# EasyEDA Pro project Uchicha .eprj

# Schematic uchiha
Board Name: uchiha; Create Date: 2025-07-20; Page Name: uchiha; Project Name: Uchicha; Schematic Name: uchiha; Update Date: 2025-07-20; File: uchiha; Id: /; Sheet: /
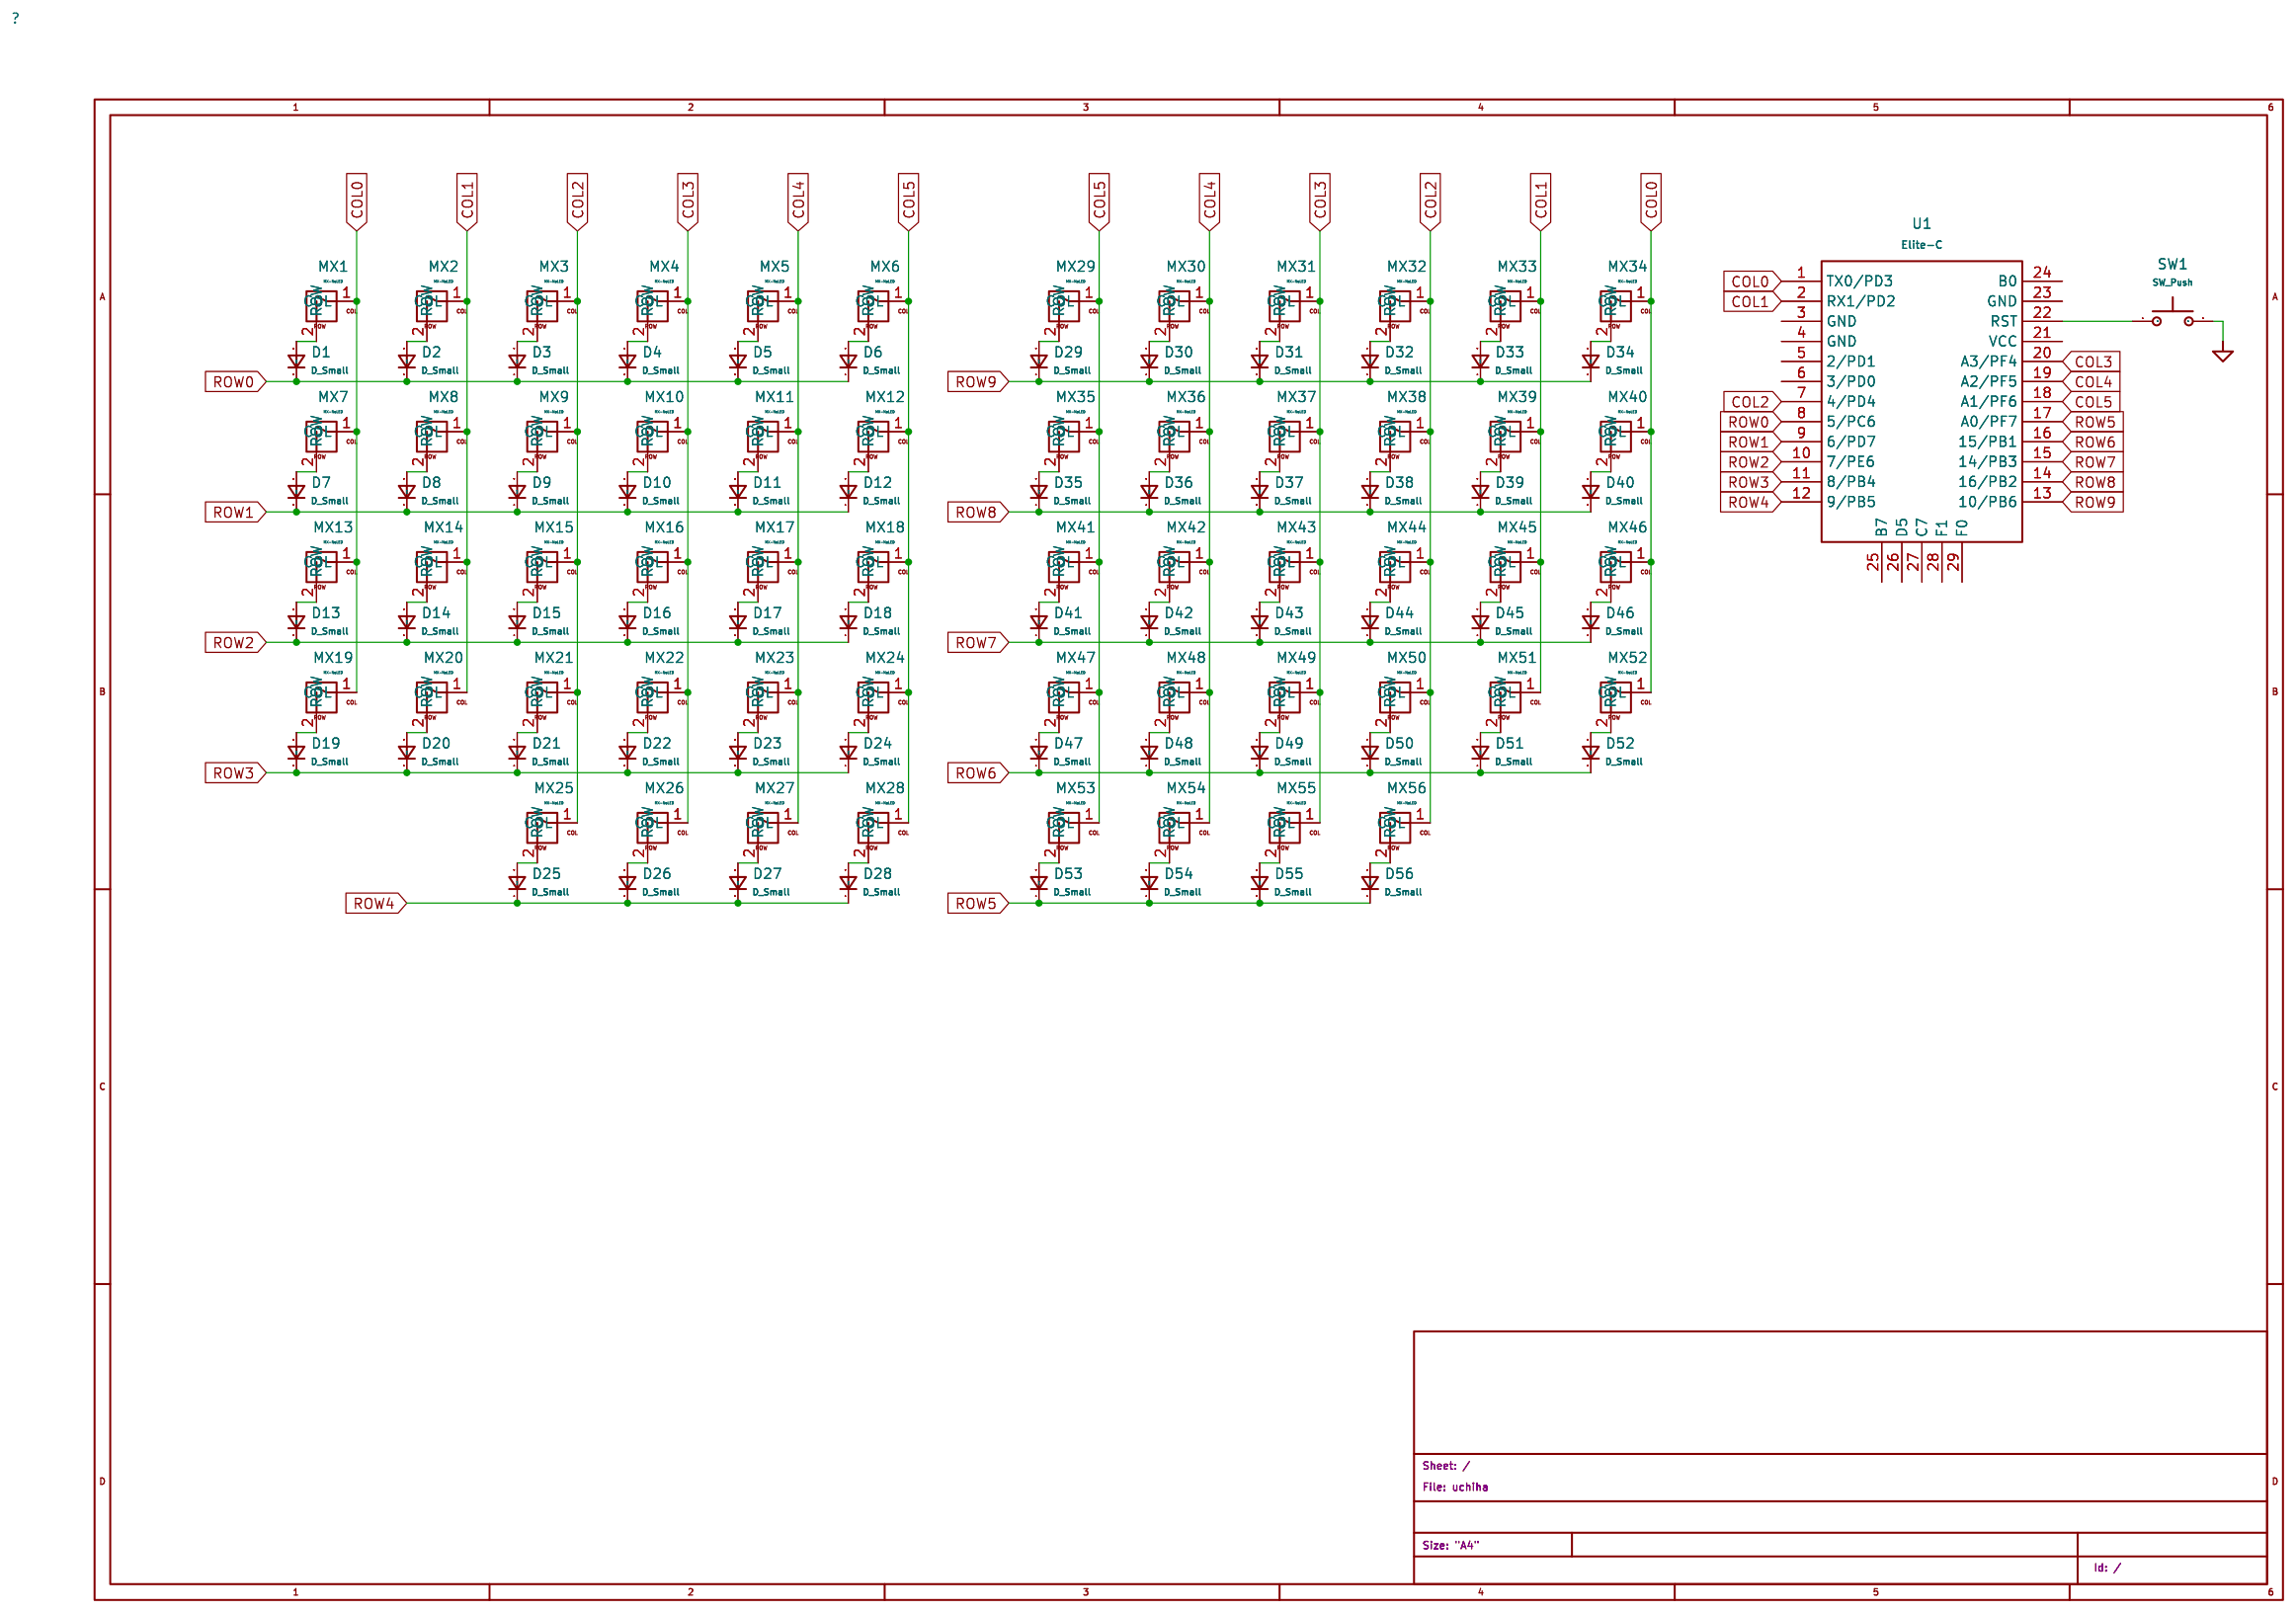
[diagram p0: schematic sheet]

## Parts
D1  D_Small
D2  D_Small
D3  D_Small
D4  D_Small
D5  D_Small
D6  D_Small
D7  D_Small
D8  D_Small
D9  D_Small
D10  D_Small
D11  D_Small
D12  D_Small
D13  D_Small
D14  D_Small
D15  D_Small
D16  D_Small
D17  D_Small
D18  D_Small
D19  D_Small
D20  D_Small
D21  D_Small
D22  D_Small
D23  D_Small
D24  D_Small
D25  D_Small
D26  D_Small
D27  D_Small
D28  D_Small
D29  D_Small
D30  D_Small
D31  D_Small
D32  D_Small
D33  D_Small
D34  D_Small
D35  D_Small
D36  D_Small
D37  D_Small
D38  D_Small
D39  D_Small
D40  D_Small
D41  D_Small
D42  D_Small
D43  D_Small
D44  D_Small
D45  D_Small
D46  D_Small
D47  D_Small
D48  D_Small
D49  D_Small
D50  D_Small
D51  D_Small
D52  D_Small
D53  D_Small
D54  D_Small
D55  D_Small
D56  D_Small
MX1  MX-NoLED
MX2  MX-NoLED
MX3  MX-NoLED
MX4  MX-NoLED
MX5  MX-NoLED
MX6  MX-NoLED
MX7  MX-NoLED
MX8  MX-NoLED
MX9  MX-NoLED
MX10  MX-NoLED
MX11  MX-NoLED
MX12  MX-NoLED
MX13  MX-NoLED
MX14  MX-NoLED
MX15  MX-NoLED
MX16  MX-NoLED
MX17  MX-NoLED
MX18  MX-NoLED
MX19  MX-NoLED
MX20  MX-NoLED
MX21  MX-NoLED
MX22  MX-NoLED
MX23  MX-NoLED
MX24  MX-NoLED
MX25  MX-NoLED
MX26  MX-NoLED
MX27  MX-NoLED
MX28  MX-NoLED
MX29  MX-NoLED
MX30  MX-NoLED
MX31  MX-NoLED
MX32  MX-NoLED
MX33  MX-NoLED
MX34  MX-NoLED
MX35  MX-NoLED
MX36  MX-NoLED
MX37  MX-NoLED
MX38  MX-NoLED
MX39  MX-NoLED
MX40  MX-NoLED
MX41  MX-NoLED
MX42  MX-NoLED
MX43  MX-NoLED
MX44  MX-NoLED
MX45  MX-NoLED
MX46  MX-NoLED
MX47  MX-NoLED
MX48  MX-NoLED
MX49  MX-NoLED
MX50  MX-NoLED
MX51  MX-NoLED
MX52  MX-NoLED
MX53  MX-NoLED
MX54  MX-NoLED
MX55  MX-NoLED
MX56  MX-NoLED
SW1  SW_Push
U1  Elite-C

## Library data of the parts
D1-D56 = Device_D_Small
MX1-MX56 = MX_Alps_Hybrid_MX-NoLED
SW1 = Switch_SW_Push
U1 = keebio_Elite-C

## Nets
COL0: MX1.1(COL) MX7.1(COL) MX13.1(COL) MX19.1(COL) MX34.1(COL) MX40.1(COL) MX46.1(COL) MX52.1(COL) U1.1(TX0/PD3)
COL1: MX2.1(COL) MX8.1(COL) MX14.1(COL) MX20.1(COL) MX33.1(COL) MX39.1(COL) MX45.1(COL) MX51.1(COL) U1.2(RX1/PD2)
COL2: MX3.1(COL) MX9.1(COL) MX15.1(COL) MX21.1(COL) MX25.1(COL) MX32.1(COL) MX38.1(COL) MX44.1(COL) MX50.1(COL) MX56.1(COL) U1.7(4/PD4)
COL3: MX4.1(COL) MX10.1(COL) MX16.1(COL) MX22.1(COL) MX26.1(COL) MX31.1(COL) MX37.1(COL) MX43.1(COL) MX49.1(COL) MX55.1(COL) U1.20(A3/PF4)
COL4: MX5.1(COL) MX11.1(COL) MX17.1(COL) MX23.1(COL) MX27.1(COL) MX30.1(COL) MX36.1(COL) MX42.1(COL) MX48.1(COL) MX54.1(COL) U1.19(A2/PF5)
COL5: MX6.1(COL) MX12.1(COL) MX18.1(COL) MX24.1(COL) MX28.1(COL) MX29.1(COL) MX35.1(COL) MX41.1(COL) MX47.1(COL) MX53.1(COL) U1.18(A1/PF6)
POWER_GND: SW1.2
ROW0: D1.1(K) D2.1(K) D3.1(K) D4.1(K) D5.1(K) D6.1(K) U1.8(5/PC6)
ROW1: D7.1(K) D8.1(K) D9.1(K) D10.1(K) D11.1(K) D12.1(K) U1.9(6/PD7)
ROW2: D13.1(K) D14.1(K) D15.1(K) D16.1(K) D17.1(K) D18.1(K) U1.10(7/PE6)
ROW3: D19.1(K) D20.1(K) D21.1(K) D22.1(K) D23.1(K) D24.1(K) U1.11(8/PB4)
ROW4: D25.1(K) D26.1(K) D27.1(K) D28.1(K) U1.12(9/PB5)
ROW5: D53.1(K) D54.1(K) D55.1(K) D56.1(K) U1.17(A0/PF7)
ROW6: D47.1(K) D48.1(K) D49.1(K) D50.1(K) D51.1(K) D52.1(K) U1.16(15/PB1)
ROW7: D41.1(K) D42.1(K) D43.1(K) D44.1(K) D45.1(K) D46.1(K) U1.15(14/PB3)
ROW8: D35.1(K) D36.1(K) D37.1(K) D38.1(K) D39.1(K) D40.1(K) U1.14(16/PB2)
ROW9: D29.1(K) D30.1(K) D31.1(K) D32.1(K) D33.1(K) D34.1(K) U1.13(10/PB6)
Net-(D1-2): D1.2(A) MX1.2(ROW)
Net-(D2-2): D2.2(A) MX2.2(ROW)
Net-(D3-2): D3.2(A) MX3.2(ROW)
Net-(D4-2): D4.2(A) MX4.2(ROW)
Net-(D5-2): D5.2(A) MX5.2(ROW)
Net-(D6-2): D6.2(A) MX6.2(ROW)
Net-(D7-2): D7.2(A) MX7.2(ROW)
Net-(D8-2): D8.2(A) MX8.2(ROW)
Net-(D9-2): D9.2(A) MX9.2(ROW)
Net-(D10-2): D10.2(A) MX10.2(ROW)
Net-(D11-2): D11.2(A) MX11.2(ROW)
Net-(D12-2): D12.2(A) MX12.2(ROW)
Net-(D13-2): D13.2(A) MX13.2(ROW)
Net-(D14-2): D14.2(A) MX14.2(ROW)
Net-(D15-2): D15.2(A) MX15.2(ROW)
Net-(D16-2): D16.2(A) MX16.2(ROW)
Net-(D17-2): D17.2(A) MX17.2(ROW)
Net-(D18-2): D18.2(A) MX18.2(ROW)
Net-(D19-2): D19.2(A) MX19.2(ROW)
Net-(D20-2): D20.2(A) MX20.2(ROW)
Net-(D21-2): D21.2(A) MX21.2(ROW)
Net-(D22-2): D22.2(A) MX22.2(ROW)
Net-(D23-2): D23.2(A) MX23.2(ROW)
Net-(D24-2): D24.2(A) MX24.2(ROW)
Net-(D25-2): D25.2(A) MX25.2(ROW)
Net-(D26-2): D26.2(A) MX26.2(ROW)
Net-(D27-2): D27.2(A) MX27.2(ROW)
Net-(D28-2): D28.2(A) MX28.2(ROW)
Net-(D29-2): D29.2(A) MX29.2(ROW)
Net-(D30-2): D30.2(A) MX30.2(ROW)
Net-(D31-2): D31.2(A) MX31.2(ROW)
Net-(D32-2): D32.2(A) MX32.2(ROW)
Net-(D33-2): D33.2(A) MX33.2(ROW)
Net-(D34-2): D34.2(A) MX34.2(ROW)
Net-(D35-2): D35.2(A) MX35.2(ROW)
Net-(D36-2): D36.2(A) MX36.2(ROW)
Net-(D37-2): D37.2(A) MX37.2(ROW)
Net-(D38-2): D38.2(A) MX38.2(ROW)
Net-(D39-2): D39.2(A) MX39.2(ROW)
Net-(D40-2): D40.2(A) MX40.2(ROW)
Net-(D41-2): D41.2(A) MX41.2(ROW)
Net-(D42-2): D42.2(A) MX42.2(ROW)
Net-(D43-2): D43.2(A) MX43.2(ROW)
Net-(D44-2): D44.2(A) MX44.2(ROW)
Net-(D45-2): D45.2(A) MX45.2(ROW)
Net-(D46-2): D46.2(A) MX46.2(ROW)
Net-(D47-2): D47.2(A) MX47.2(ROW)
Net-(D48-2): D48.2(A) MX48.2(ROW)
Net-(D49-2): D49.2(A) MX49.2(ROW)
Net-(D50-2): D50.2(A) MX50.2(ROW)
Net-(D51-2): D51.2(A) MX51.2(ROW)
Net-(D52-2): D52.2(A) MX52.2(ROW)
Net-(D53-2): D53.2(A) MX53.2(ROW)
Net-(D54-2): D54.2(A) MX54.2(ROW)
Net-(D55-2): D55.2(A) MX55.2(ROW)
Net-(D56-2): D56.2(A) MX56.2(ROW)
Net-(SW1-1): SW1.1 U1.22(RST)

Not connected (* = marked no-connect by the designer): U1 3(GND) 4(GND) 5(2/PD1) 6(3/PD0) 21(VCC) 23(GND) 24(B0) 25(B7) 26(D5) 27(C7) 28(F1) 29(F0)

# Board uchiha
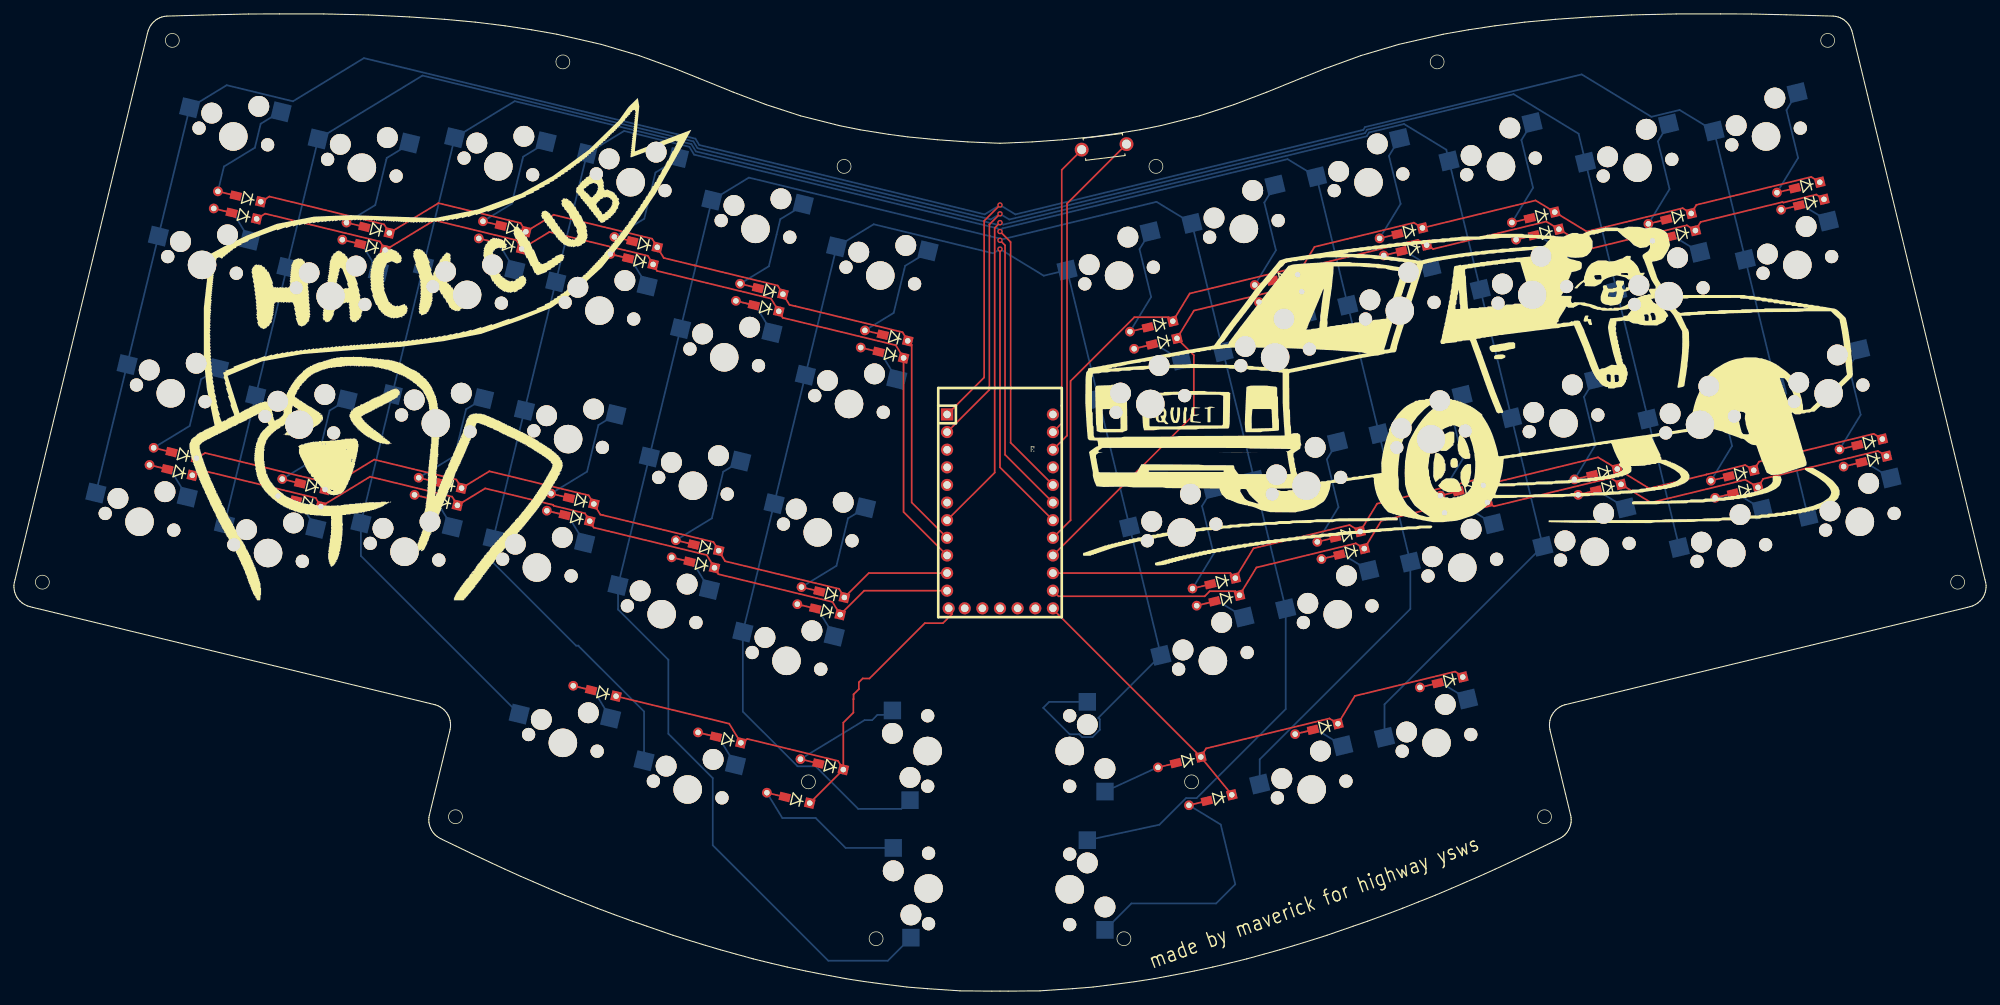
[diagram p1: board, top side]
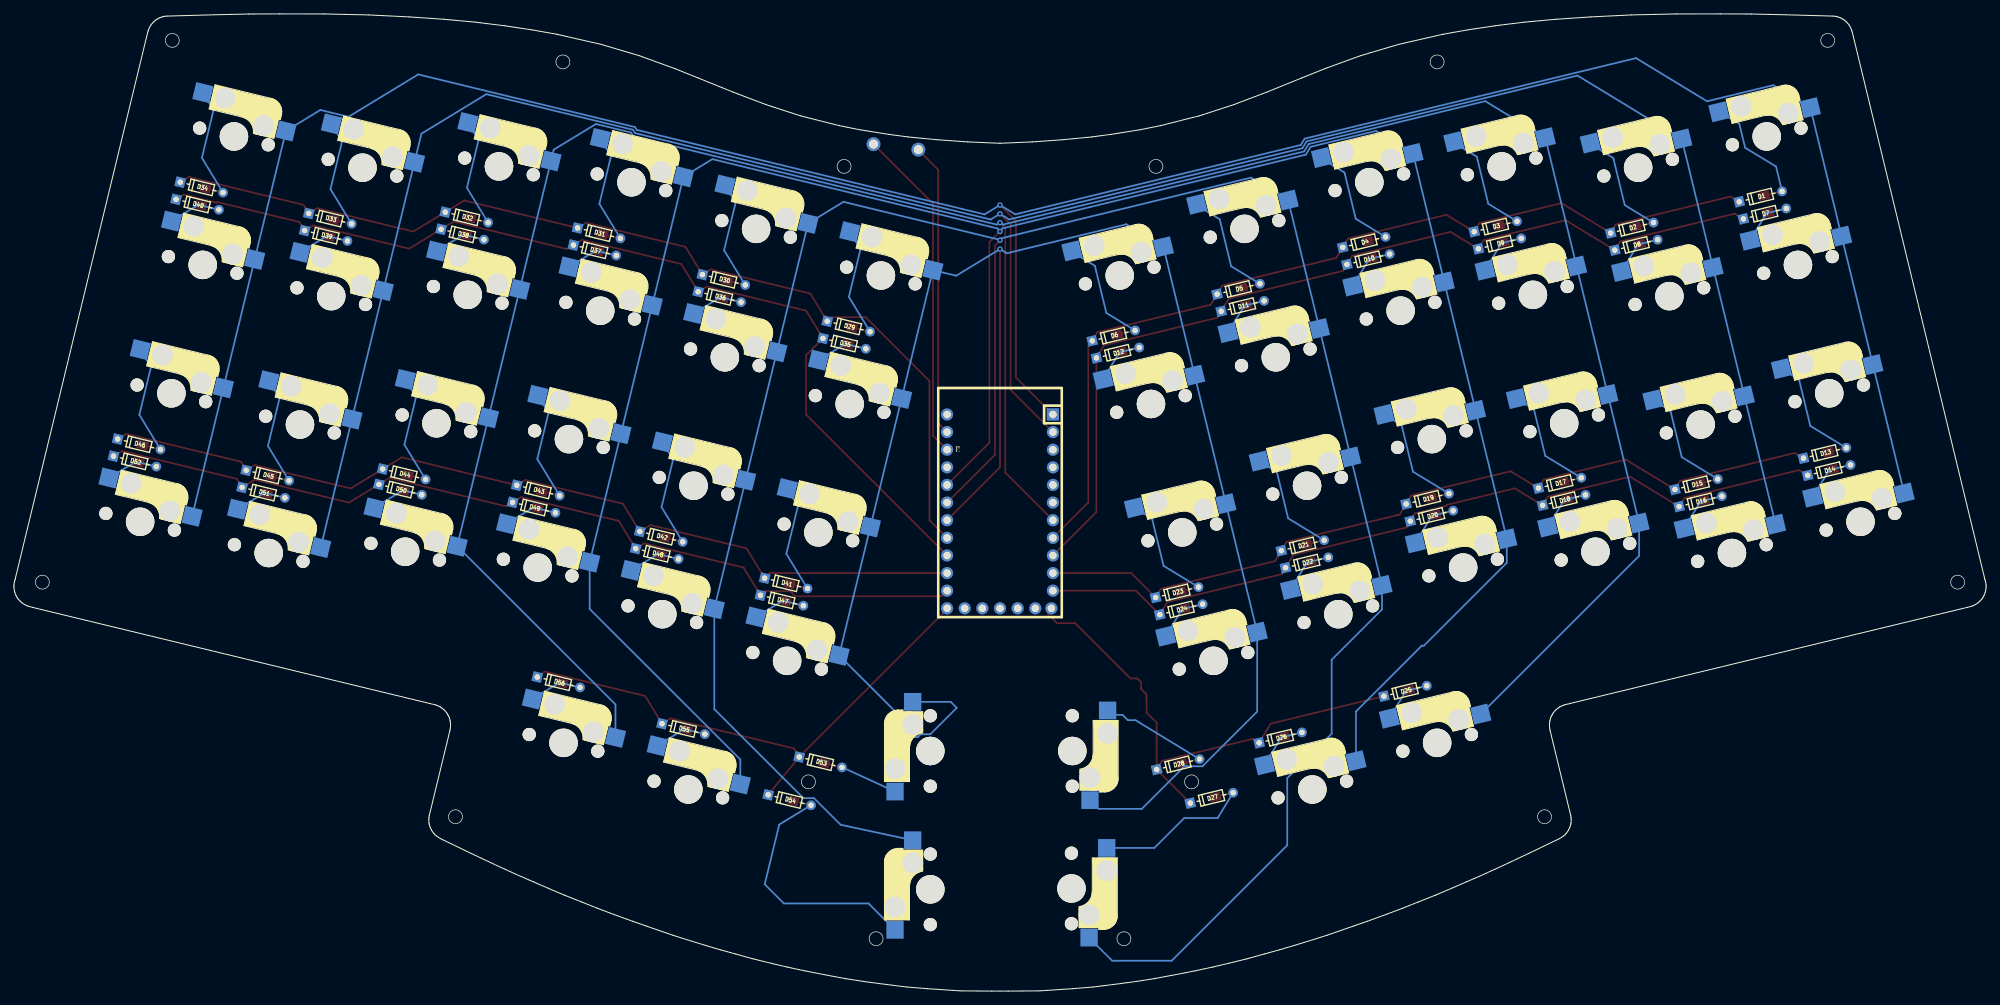
[diagram p2: board, bottom side, seen from below]

Outline 283.96 x 140.84 mm; copper layers: Top Layer, Bottom Layer. Coordinates in mm from the lower left corner of the outline.
Stack: Top Layer 0.035mm / Dielectric1 1.51mm FR4 er 4.5 / Bottom Layer 0.035mm

## Design rules (mm)
spacing safeClearance (default): track to track 0.152, other pairs 0.152 to 0.3
track width trackWidth (default): min 0.127, default 0.254, max 2.54
differential pair differentialPair (default): width min 0.127, default 0.254, max 2.54; gap min 0.152, default 0.152
via viaSize (default): diameter min 0.5, default 0.61, max 10; hole min 0.3, default 0.305, max 6

## Placement (name value [footprint] x y rotation side)
D1  D_Small  [atreis:D3_hybrid_common_hole]  35.55 113.76 166.3 bottom
D2  D_Small  [atreis:D3_hybrid_common_hole]  54.06 109.26 166.3 bottom
D3  D_Small  [atreis:D3_hybrid_common_hole]  73.71 109.45 166.3 bottom
D4  D_Small  [atreis:D3_hybrid_common_hole]  92.63 107.2 166.3 bottom
D5  D_Small  [atreis:D3_hybrid_common_hole]  110.73 100.44 166.3 bottom
D6  D_Small  [atreis:D3_hybrid_common_hole]  128.7 93.72 166.3 bottom
D7  D_Small  [atreis:D3_hybrid_common_hole]  34.95 111.3 166.3 bottom
D8  D_Small  [atreis:D3_hybrid_common_hole]  53.46 106.79 166.3 bottom
D9  D_Small  [atreis:D3_hybrid_common_hole]  73.11 106.98 166.3 bottom
D10  D_Small  [atreis:D3_hybrid_common_hole]  92.03 104.73 166.3 bottom
D11  D_Small  [atreis:D3_hybrid_common_hole]  110.13 97.98 166.3 bottom
D12  D_Small  [atreis:D3_hybrid_common_hole]  128.1 91.25 166.3 bottom
D13  D_Small  [atreis:D3_hybrid_common_hole]  26.29 76.8 166.3 bottom
D14  D_Small  [atreis:D3_hybrid_common_hole]  25.69 74.33 166.3 bottom
D15  D_Small  [atreis:D3_hybrid_common_hole]  44.8 72.3 166.3 bottom
D16  D_Small  [atreis:D3_hybrid_common_hole]  44.2 69.83 166.3 bottom
D17  D_Small  [atreis:D3_hybrid_common_hole]  64.46 72.49 166.3 bottom
D18  D_Small  [atreis:D3_hybrid_common_hole]  63.86 70.02 166.3 bottom
D19  D_Small  [atreis:D3_hybrid_common_hole]  83.51 70.21 166.3 bottom
D20  D_Small  [atreis:D3_hybrid_common_hole]  82.91 67.74 166.3 bottom
D21  D_Small  [atreis:D3_hybrid_common_hole]  101.48 63.48 166.3 bottom
D22  D_Small  [atreis:D3_hybrid_common_hole]  100.88 61.02 166.3 bottom
D23  D_Small  [atreis:D3_hybrid_common_hole]  119.57 56.73 166.3 bottom
D24  D_Small  [atreis:D3_hybrid_common_hole]  118.97 54.26 166.3 bottom
D25  D_Small  [atreis:D3_hybrid_common_hole]  86.7 42.5 166.3 bottom
D26  D_Small  [atreis:D3_hybrid_common_hole]  104.67 35.78 166.3 bottom
D27  D_Small  [atreis:D3_hybrid_common_hole]  114.58 27.1 166.3 bottom
D28  D_Small  [atreis:D3_hybrid_common_hole]  119.42 31.93 166.3 bottom
D29  D_Small  [atreis:D3_hybrid_common_hole]  166.86 96.54 193.7 bottom
D30  D_Small  [atreis:D3_hybrid_common_hole]  184.83 103.27 193.7 bottom
D31  D_Small  [atreis:D3_hybrid_common_hole]  202.8 109.99 193.7 bottom
D32  D_Small  [atreis:D3_hybrid_common_hole]  221.85 112.27 193.7 bottom
D33  D_Small  [atreis:D3_hybrid_common_hole]  241.5 112.08 193.7 bottom
D34  D_Small  [atreis:D3_hybrid_common_hole]  260.01 116.59 193.7 bottom
D35  D_Small  [atreis:D3_hybrid_common_hole]  167.46 94.07 193.7 bottom
D36  D_Small  [atreis:D3_hybrid_common_hole]  185.43 100.8 193.7 bottom
D37  D_Small  [atreis:D3_hybrid_common_hole]  203.4 107.52 193.7 bottom
D38  D_Small  [atreis:D3_hybrid_common_hole]  222.45 109.8 193.7 bottom
D39  D_Small  [atreis:D3_hybrid_common_hole]  242.1 109.61 193.7 bottom
D40  D_Small  [atreis:D3_hybrid_common_hole]  260.61 114.12 193.7 bottom
D41  D_Small  [atreis:D3_hybrid_common_hole]  175.87 59.52 193.7 bottom
D42  D_Small  [atreis:D3_hybrid_common_hole]  193.84 66.25 193.7 bottom
D43  D_Small  [atreis:D3_hybrid_common_hole]  211.56 72.91 193.7 bottom
D44  D_Small  [atreis:D3_hybrid_common_hole]  230.86 75.25 193.7 bottom
D45  D_Small  [atreis:D3_hybrid_common_hole]  250.51 75.06 193.7 bottom
D46  D_Small  [atreis:D3_hybrid_common_hole]  269.02 79.56 193.7 bottom
D47  D_Small  [atreis:D3_hybrid_common_hole]  176.47 57.05 193.7 bottom
D48  D_Small  [atreis:D3_hybrid_common_hole]  194.44 63.78 193.7 bottom
D49  D_Small  [atreis:D3_hybrid_common_hole]  212.16 70.44 193.7 bottom
D50  D_Small  [atreis:D3_hybrid_common_hole]  231.4 73.03 193.7 bottom
D51  D_Small  [atreis:D3_hybrid_common_hole]  251.11 72.59 193.7 bottom
D52  D_Small  [atreis:D3_hybrid_common_hole]  269.62 77.1 193.7 bottom
D53  D_Small  [atreis:D3_hybrid_common_hole]  170.9 33.74 193.7 bottom
D54  D_Small  [atreis:D3_hybrid_common_hole]  175.36 28.29 193.7 bottom
D55  D_Small  [atreis:D3_hybrid_common_hole]  190.64 38.54 193.7 bottom
D56  D_Small  [atreis:D3_hybrid_common_hole]  208.61 45.27 193.7 bottom
MX1  MX-NoLED  [kbd:CherryMX_Hotswap]  31.59 123.17 166.3 bottom
MX2  MX-NoLED  [kbd:CherryMX_Hotswap]  50.1 118.67 166.3 bottom
MX3  MX-NoLED  [kbd:CherryMX_Hotswap]  69.75 118.86 166.3 bottom
MX4  MX-NoLED  [kbd:CherryMX_Hotswap]  88.8 116.58 166.3 bottom
MX5  MX-NoLED  [kbd:CherryMX_Hotswap]  106.77 109.85 166.3 bottom
MX6  MX-NoLED  [kbd:CherryMX_Hotswap]  124.74 103.13 166.3 bottom
MX7  MX-NoLED  [kbd:CherryMX_Hotswap]  27.09 104.66 166.3 bottom
MX8  MX-NoLED  [kbd:CherryMX_Hotswap]  45.6 100.16 166.3 bottom
MX9  MX-NoLED  [kbd:CherryMX_Hotswap]  65.25 100.35 166.3 bottom
MX10  MX-NoLED  [kbd:CherryMX_Hotswap]  84.3 98.07 166.3 bottom
MX11  MX-NoLED  [kbd:CherryMX_Hotswap]  102.27 91.34 166.3 bottom
MX12  MX-NoLED  [kbd:CherryMX_Hotswap]  120.24 84.62 166.3 bottom
MX13  MX-NoLED  [kbd:CherryMX_Hotswap]  22.59 86.15 166.3 bottom
MX14  MX-NoLED  [kbd:CherryMX_Hotswap]  41.1 81.65 166.3 bottom
MX15  MX-NoLED  [kbd:CherryMX_Hotswap]  60.75 81.84 166.3 bottom
MX16  MX-NoLED  [kbd:CherryMX_Hotswap]  79.8 79.56 166.3 bottom
MX17  MX-NoLED  [kbd:CherryMX_Hotswap]  97.77 72.83 166.3 bottom
MX18  MX-NoLED  [kbd:CherryMX_Hotswap]  115.74 66.11 166.3 bottom
MX19  MX-NoLED  [kbd:CherryMX_Hotswap]  18.09 67.64 166.3 bottom
MX20  MX-NoLED  [kbd:CherryMX_Hotswap]  36.6 63.14 166.3 bottom
MX21  MX-NoLED  [kbd:CherryMX_Hotswap]  56.25 63.33 166.3 bottom
MX22  MX-NoLED  [kbd:CherryMX_Hotswap]  75.3 61.05 166.3 bottom
MX23  MX-NoLED  [kbd:CherryMX_Hotswap]  93.27 54.32 166.3 bottom
MX24  MX-NoLED  [kbd:CherryMX_Hotswap]  111.24 47.6 166.3 bottom
MX25  MX-NoLED  [kbd:CherryMX_Hotswap]  79.04 35.78 166.3 bottom
MX26  MX-NoLED  [kbd:CherryMX_Hotswap]  97.01 29.06 166.3 bottom
MX27  MX-NoLED  [kbd:CherryMX_Hotswap]  131.69 14.79 270 bottom
MX28  MX-NoLED  [kbd:CherryMX_Hotswap]  131.57 34.61 270 bottom
MX29  MX-NoLED  [kbd:CherryMX_Hotswap]  159.12 103.13 193.7 bottom
MX30  MX-NoLED  [kbd:CherryMX_Hotswap]  177.09 109.85 193.7 bottom
MX31  MX-NoLED  [kbd:CherryMX_Hotswap]  195.04 116.57 193.7 bottom
MX32  MX-NoLED  [kbd:CherryMX_Hotswap]  214.12 118.86 193.7 bottom
MX33  MX-NoLED  [kbd:CherryMX_Hotswap]  233.77 118.67 193.7 bottom
MX34  MX-NoLED  [kbd:CherryMX_Hotswap]  252.28 123.17 193.7 bottom
MX35  MX-NoLED  [kbd:CherryMX_Hotswap]  163.63 84.62 193.7 bottom
MX36  MX-NoLED  [kbd:CherryMX_Hotswap]  181.6 91.34 193.7 bottom
MX37  MX-NoLED  [kbd:CherryMX_Hotswap]  199.54 98.06 193.7 bottom
MX38  MX-NoLED  [kbd:CherryMX_Hotswap]  218.62 100.35 193.7 bottom
MX39  MX-NoLED  [kbd:CherryMX_Hotswap]  238.27 100.16 193.7 bottom
MX40  MX-NoLED  [kbd:CherryMX_Hotswap]  256.78 104.66 193.7 bottom
MX41  MX-NoLED  [kbd:CherryMX_Hotswap]  168.13 66.11 193.7 bottom
MX42  MX-NoLED  [kbd:CherryMX_Hotswap]  186.1 72.83 193.7 bottom
MX43  MX-NoLED  [kbd:CherryMX_Hotswap]  204.04 79.55 193.7 bottom
MX44  MX-NoLED  [kbd:CherryMX_Hotswap]  223.12 81.84 193.7 bottom
MX45  MX-NoLED  [kbd:CherryMX_Hotswap]  242.77 81.65 193.7 bottom
MX46  MX-NoLED  [kbd:CherryMX_Hotswap]  261.28 86.15 193.7 bottom
MX47  MX-NoLED  [kbd:CherryMX_Hotswap]  172.63 47.6 193.7 bottom
MX48  MX-NoLED  [kbd:CherryMX_Hotswap]  190.6 54.32 193.7 bottom
MX49  MX-NoLED  [kbd:CherryMX_Hotswap]  208.55 61.04 193.7 bottom
MX50  MX-NoLED  [kbd:CherryMX_Hotswap]  227.62 63.33 193.7 bottom
MX51  MX-NoLED  [kbd:CherryMX_Hotswap]  247.27 63.14 193.7 bottom
MX52  MX-NoLED  [kbd:CherryMX_Hotswap]  265.78 67.64 193.7 bottom
MX53  MX-NoLED  [kbd:CherryMX_Hotswap]  152.01 34.61 90 bottom
MX54  MX-NoLED  [kbd:CherryMX_Hotswap]  152.01 14.67 90 bottom
MX55  MX-NoLED  [kbd:CherryMX_Hotswap]  186.86 29.06 193.7 bottom
MX56  MX-NoLED  [kbd:CherryMX_Hotswap]  204.83 35.78 193.7 bottom
SW1  SW_Push  [kbd:ResetSW_1side]  156.97 121.67 7 top
U1  Elite-C  [Keebio-Parts:Elite-C]  141.98 69.14 270 top

## Footprints (pads in the part's own frame, mm; a bottom-side part is the same pattern mirrored in y, then rotated)
atreis:D3_hybrid_common_hole
  rect 1.4x1.4 hole 0.8: 1(0,0)
  rect 1.6x1.2 smd far side: 2(3.7,0)
  round 1.4 hole 0.8: 2(6.35,0)
kbd:CherryMX_Hotswap
  round 1.9 hole 1.9: (-5.08,0) (5.08,0)
  round 3 hole 3: (-2.54,5.08) (3.81,2.54)
  round 4.1 hole 4.1: (0,0)
  rect 2.55x2.5 smd: 1(7.085,2.54) 2(-5.842,5.08)
kbd:ResetSW_1side
  round 2 hole 1.3: 1(3.25,0) 2(-3.25,0)
Keebio-Parts:Elite-C
  rect 1.752x1.752 hole 1.092: 1(-13.97,-7.62)
  round 1.752 hole 1.092: 2(-11.43,-7.62) 3(-8.89,-7.62) 4(-6.35,-7.62) 5(-3.81,-7.62) 6(-1.27,-7.62) 7(1.27,-7.62) 8(3.81,-7.62) 9(6.35,-7.62) 10(8.89,-7.62) 11(11.43,-7.62) 12(13.97,-7.391) 13(13.97,7.62) 14(11.43,7.62) 15(8.89,7.62) 16(6.35,7.62) 17(3.81,7.62) 18(1.27,7.62) 19(-1.27,7.62) 20(-3.81,7.62) 21(-6.35,7.62) 22(-8.89,7.62) 23(-11.43,7.62) 24(-13.97,7.62) 25(13.97,-5.08) 26(13.97,-2.54) 27(13.97,0) 28(13.97,2.54) 29(13.97,5.08)

## Nets
GND: SW1.2 U1.3 U1.4 U1.23
COL0: MX1.1 MX7.1 MX13.1 MX19.1 MX34.1 MX40.1 MX46.1 MX52.1 U1.1
COL1: MX2.1 MX8.1 MX14.1 MX20.1 MX33.1 MX39.1 MX45.1 MX51.1 U1.2
COL2: MX3.1 MX9.1 MX15.1 MX21.1 MX25.1 MX32.1 MX38.1 MX44.1 MX50.1 MX56.1 U1.7
COL3: MX4.1 MX10.1 MX16.1 MX22.1 MX26.1 MX31.1 MX37.1 MX43.1 MX49.1 MX55.1 U1.20
COL4: MX5.1 MX11.1 MX17.1 MX23.1 MX27.1 MX30.1 MX36.1 MX42.1 MX48.1 MX54.1 U1.19
COL5: MX6.1 MX12.1 MX18.1 MX24.1 MX28.1 MX29.1 MX35.1 MX41.1 MX47.1 MX53.1 U1.18
NET-(D1-PAD2): D1.2 MX1.2
NET-(D2-PAD2): D2.2 MX2.2
NET-(D3-PAD2): D3.2 MX3.2
NET-(D4-PAD2): D4.2 MX4.2
NET-(D5-PAD2): D5.2 MX5.2
NET-(D6-PAD2): D6.2 MX6.2
NET-(D7-PAD2): D7.2 MX7.2
NET-(D8-PAD2): D8.2 MX8.2
NET-(D9-PAD2): D9.2 MX9.2
NET-(D10-PAD2): D10.2 MX10.2
NET-(D11-PAD2): D11.2 MX11.2
NET-(D12-PAD2): D12.2 MX12.2
NET-(D13-PAD2): D13.2 MX13.2
NET-(D14-PAD2): D15.2 MX14.2
NET-(D15-PAD2): D17.2 MX15.2
NET-(D16-PAD2): D19.2 MX16.2
NET-(D17-PAD2): D21.2 MX17.2
NET-(D18-PAD2): D23.2 MX18.2
NET-(D19-PAD2): D14.2 MX19.2
NET-(D20-PAD2): D16.2 MX20.2
NET-(D21-PAD2): D18.2 MX21.2
NET-(D22-PAD2): D20.2 MX22.2
NET-(D23-PAD2): D22.2 MX23.2
NET-(D24-PAD2): D24.2 MX24.2
NET-(D25-PAD2): D25.2 MX25.2
NET-(D26-PAD2): D26.2 MX26.2
NET-(D27-PAD2): D27.2 MX27.2
NET-(D28-PAD2): D28.2 MX28.2
NET-(D29-PAD2): D29.2 MX29.2
NET-(D30-PAD2): D30.2 MX30.2
NET-(D31-PAD2): D31.2 MX31.2
NET-(D32-PAD2): D32.2 MX32.2
NET-(D33-PAD2): D33.2 MX33.2
NET-(D34-PAD2): D34.2 MX34.2
NET-(D35-PAD2): D35.2 MX35.2
NET-(D36-PAD2): D36.2 MX36.2
NET-(D37-PAD2): D37.2 MX37.2
NET-(D38-PAD2): D38.2 MX38.2
NET-(D39-PAD2): D39.2 MX39.2
NET-(D40-PAD2): D40.2 MX40.2
NET-(D41-PAD2): D41.2 MX41.2
NET-(D42-PAD2): D42.2 MX42.2
NET-(D43-PAD2): D43.2 MX43.2
NET-(D44-PAD2): D44.2 MX44.2
NET-(D45-PAD2): D45.2 MX45.2
NET-(D46-PAD2): D46.2 MX46.2
NET-(D47-PAD2): D47.2 MX47.2
NET-(D48-PAD2): D48.2 MX48.2
NET-(D49-PAD2): D49.2 MX49.2
NET-(D50-PAD2): D50.2 MX50.2
NET-(D51-PAD2): D51.2 MX51.2
NET-(D52-PAD2): D52.2 MX52.2
NET-(D53-PAD2): D53.2 MX53.2
NET-(D54-PAD2): D54.2 MX54.2
NET-(D55-PAD2): D55.2 MX55.2
NET-(D56-PAD2): D56.2 MX56.2
NET-(SW1-PAD1): SW1.1 U1.22
ROW0: D1.1 D2.1 D3.1 D4.1 D5.1 D6.1 U1.8
ROW1: D7.1 D8.1 D9.1 D10.1 D11.1 D12.1 U1.9
ROW2: D13.1 D15.1 D17.1 D19.1 D21.1 D23.1 U1.10
ROW3: D14.1 D16.1 D18.1 D20.1 D22.1 D24.1 U1.11
ROW4: D25.1 D26.1 D27.1 D28.1 U1.12
ROW5: D29.1 D30.1 D31.1 D32.1 D33.1 D34.1 U1.17
ROW6: D35.1 D36.1 D37.1 D38.1 D39.1 D40.1 U1.16
ROW7: D41.1 D42.1 D43.1 D44.1 D45.1 D46.1 U1.15
ROW8: D47.1 D48.1 D49.1 D50.1 D51.1 D52.1 U1.14
ROW9: D53.1 D54.1 D55.1 D56.1 U1.13
UNCONNECTED-(U1-PAD5): U1.5
UNCONNECTED-(U1-PAD6): U1.6
UNCONNECTED-(U1-PAD21): U1.21
UNCONNECTED-(U1-PAD24): U1.24
UNCONNECTED-(U1-PAD25): U1.25
UNCONNECTED-(U1-PAD26): U1.26
UNCONNECTED-(U1-PAD27): U1.27
UNCONNECTED-(U1-PAD28): U1.28
UNCONNECTED-(U1-PAD29): U1.29

## Via types
v1: diameter 0.8, hole 0.4, Top Layer to Bottom Layer, 6 vias

## Routing (per net, layer and track width the routed paths; a pad name or vN(x,y) marks a point on that pad's centre or on a via; arc(x,y) is an arc through that point)
GND: length 42.4
  Top Layer w0.25: SW1.2 153.74,121.24 150.87,118.37 150.87,81.84 U1.23
COL0: length 379.4
  Top Layer w0.25: U1.1 139.69,88.44 139.69,111 v1(141.98,113.29)
  Bottom Layer w0.25: 249.37,105.14 MX34.1 239.82,126.99 235.77,126.01 225.73,132.12 194.53,124.53 194.29,124.13 144.19,111.94 v1(141.98,113.29) 139.77,111.95 98.68,121.94 98.12,122.86 50.39,134.46 40.17,128.24 30.64,130.56 MX1.1 MX7.1 MX13.1 11.8,71.78 ; 253.73,87.09 253.75,87.13 MX40.1 ; MX46.1 258.31,68.37
COL1: length 344.7
  Top Layer w0.25: U1.2 140.46,86.67 140.46,110.5 v1(141.98,112.02)
  Bottom Layer w0.25: MX14.1 30.31,67.27 30.36,67.19 ; 230.78,100.95 235.36,82.13 ; 39.42,104.45 39.37,104.54 MX2.1 58.83,131.95 97.83,122.46 98.43,121.48 140.65,111.21 v1(141.98,112.02) 143.32,111.21 194.53,123.66 194.82,124.14 215.92,129.27 225.28,123.57 MX33.1 230.74,101.14 230.71,101.09 ; MX8.1 34.81,85.78 ; MX45.1 MX51.1
COL2: length 386.5
  Top Layer w0.25: v1(141.98,110.75) 141.22,109.99 141.22,74.73 U1.7
  Bottom Layer w0.25: 58.97,104.49 54.46,85.97 54.51,85.89 ; 49.82,67.68 50.05,67.82 MX15.1 ; MX50.1 197.34,41.32 MX56.1 ; MX44.1 220.11,64.23 220.37,64.07 ; MX21.1 49.96,62.72 MX25.1 ; 211.15,101.08 MX32.1 206.24,121.26 200.15,124.97 195.11,123.74 194.78,123.2 142.44,110.47 v1(141.98,110.75) 141.53,110.47 98.19,121.01 97.55,122.07 72.11,128.26 MX3.1 58.96,104.48 59.02,104.4 ; MX38.1 215.65,82.57 215.63,82.52
COL3: length 347.2
  Top Layer w0.25: v1(141.98,109.48) 143.5,107.96 143.5,79.05 U1.20
  Bottom Layer w0.25: 73.56,83.6 73.51,83.69 MX10.1 ; 78.02,102.2 MX4.1 87.85,123.97 97.26,121.68 97.94,120.55 141.63,109.93 141.89,109.5 v1(141.98,109.48) 142.07,109.5 142.32,109.92 183.38,119.9 MX31.1 192.14,98.52 ; MX43.1 201.08,61.74 201.08,61.73 ; MX22.1 69.01,61.72 80.94,49.79 81.27,49.79 81.27,49.75 90.73,40.3 MX26.1 ; 196.64,80 196.64,80.01 192.06,98.85 ; 69.18,65.59 69.13,65.67 MX16.1 ; MX49.1 201.06,55.08 179.37,33.39 MX55.1
COL4: length 358.4
  Top Layer w0.25: U1.19 142.7,77.3 142.7,107.49 v1(141.98,108.21)
  Bottom Layer w0.25: 178.54,73.77 178.57,73.81 MX36.1 ; MX17.1 86.98,58.45 87.03,58.37 ; 96.04,95.39 95.98,95.48 MX5.1 105.82,117.24 141.81,108.49 v1(141.98,108.21) 142.03,108.28 164.51,113.75 MX30.1 174.13,92.07 ; MX23.1 86.98,55 94.22,47.76 94.23,47.76 94.23,37.09 100.62,30.69 100.62,21.01 117.26,4.38 125.82,4.38 MX27.1 ; MX42.1 183.13,55.05 ; MX54.1 164.93,23.98 168.76,27.81 170.29,27.81 183.12,40.65 MX48.1 ; MX11.1 91.48,76.97
COL5: length 265.8
  Top Layer w0.25: v1(141.98,106.94) 141.98,75.49 U1.18
  Bottom Layer w0.25: MX47.1 156.14,39.38 156.35,39.16 156.35,37.67 155.3,36.62 153.81,36.62 153.4,37.02 152.01,37.02 148.2,40.83 149.07,41.69 MX53.1 ; MX47.1 160.66,66.84 ; MX47.1 165.16,48.33 165.14,48.29 ; MX35.1 160.66,66.84 ; 160.66,66.84 160.63,66.8 ; MX28.1 127.77,26.27 121.56,26.27 115.42,32.41 112.83,32.41 104.95,40.28 MX24.1 109.46,70.25 ; 156.16,85.35 MX29.1 148.28,103.11 v1(141.98,106.94) 140.99,106.34 123.79,110.52 MX6.1 114.02,89 114.07,88.92 ; 109.56,70.4 109.51,70.49 MX12.1
NET-(D1-PAD2): length 18.3
  Top Layer w0.25: D1.2 D1.2
  Bottom Layer w0.25: 38.3,126.69 35.54,125.01 34.7,121.55 34.39,121.36 30.25,118.84 D1.2
NET-(D2-PAD2): length 18.4
  Top Layer w0.25: D2.2 D2.2
  Bottom Layer w0.25: D2.2 52.03,113.28 53.62,119.82 53.68,120.07 57.05,122.13
NET-(D3-PAD2): length 18.4
  Top Layer w0.25: 67.54,110.95 D3.2
  Bottom Layer w0.25: 67.54,110.95 71.68,113.47 73.21,119.76 73.33,120.26 76.7,122.31
NET-(D4-PAD2): length 18.5
  Top Layer w0.25: D4.2 89.04,108.07
  Bottom Layer w0.25: D4.2 90.76,111.31 92.32,117.73 92.38,117.98 95.76,120.03
NET-(D5-PAD2): length 18.4
  Top Layer w0.25: D5.2 D5.2
  Bottom Layer w0.25: D5.2 108.7,104.47 109.81,109.03 110.35,111.25 113.73,113.31
NET-(D6-PAD2): length 18.4
  Top Layer w0.25: D6.2 D6.2
  Bottom Layer w0.25: D6.2 126.67,97.74 128.2,104.04 128.32,104.53 131.7,106.58
NET-(D7-PAD2): length 10.2
  Top Layer w0.25: D7.2 D7.2
  Bottom Layer w0.25: D7.2 31.61,112.11 34.04,108.12
NET-(D8-PAD2): length 10.2
  Top Layer w0.25: D8.2 D8.2
  Bottom Layer w0.25: D8.2 50.12,107.6 52.55,103.61
NET-(D9-PAD2): length 10.2
  Top Layer w0.25: D9.2 D9.2
  Bottom Layer w0.25: D9.2 69.78,107.79 72.2,103.8
NET-(D10-PAD2): length 10.4
  Top Layer w0.25: D10.2 D10.2
  Bottom Layer w0.25: 91.25,101.52 88.83,105.51 D10.2
NET-(D11-PAD2): length 10.2
  Top Layer w0.25: D11.2 D11.2
  Bottom Layer w0.25: D11.2 106.8,98.79 109.22,94.8
NET-(D12-PAD2): length 10.2
  Top Layer w0.25: 124.5,92.13 D12.2
  Bottom Layer w0.25: D12.2 124.77,92.06 127.19,88.08
NET-(D13-PAD2): length 18.6
  Top Layer w0.25: D13.2 D13.2
  Bottom Layer w0.25: MX13.2 26.94,88.17 25.31,81.46 D13.2
NET-(D14-PAD2): length 18.6
  Top Layer w0.25: 38.63,73.8 D15.2
  Bottom Layer w0.25: 38.63,73.8 43.82,76.96 45.45,83.67 MX14.2
NET-(D15-PAD2): length 18.6
  Top Layer w0.25: D17.2 D17.2
  Bottom Layer w0.25: MX15.2 65.11,83.86 63.47,77.15 D17.2
NET-(D16-PAD2): length 18.6
  Top Layer w0.25: D19.2 D19.2
  Bottom Layer w0.25: D19.2 82.52,74.87 84.16,81.58 86.68,83.11
NET-(D17-PAD2): length 18.6
  Top Layer w0.25: D21.2 D21.2
  Bottom Layer w0.25: D21.2 100.49,68.14 102.13,74.85 MX17.2
NET-(D18-PAD2): length 18.5
  Top Layer w0.25: D23.2 115.97,57.61
  Bottom Layer w0.25: MX18.2 120.1,68.13 118.43,61.3 D23.2
NET-(D19-PAD2): length 10.4
  Top Layer w0.25: D14.2 D14.2
  Bottom Layer w0.25: MX19.2 22.59,75.09 D14.2
NET-(D20-PAD2): length 10.4
  Top Layer w0.25: 38.03,71.33 D16.2
  Bottom Layer w0.25: 38.03,71.33 41.1,70.59 43.47,66.69
NET-(D21-PAD2): length 10.4
  Top Layer w0.25: D18.2 D18.2
  Bottom Layer w0.25: D18.2 60.75,70.77 MX21.2
NET-(D22-PAD2): length 10.4
  Top Layer w0.25: D20.2 D20.2
  Bottom Layer w0.25: D20.2 79.8,68.49 MX22.2
NET-(D23-PAD2): length 10.4
  Top Layer w0.25: D22.2 D22.2
  Bottom Layer w0.25: MX23.2 97.78,61.77 D22.2
NET-(D24-PAD2): length 10.2
  Top Layer w0.25: D24.2 115.38,55.14
  Bottom Layer w0.25: MX24.2 115.75,55.05 D24.2
NET-(D25-PAD2): length 10.3
  Top Layer w0.25: 83.11,43.38 D25.2
  Bottom Layer w0.25: D25.2 83.52,43.28 MX25.2
NET-(D26-PAD2): length 10.3
  Top Layer w0.25: D26.2 D26.2
  Bottom Layer w0.25: D26.2 101.49,36.56 103.89,32.61
NET-(D27-PAD2): length 24.7
  Top Layer w0.25: D27.2 D27.2
  Bottom Layer w0.25: D27.2 110.64,24.95 115.44,24.95 119.76,20.64 MX27.2
NET-(D28-PAD2): length 18
  Top Layer w0.25: D28.2 D28.2
  Bottom Layer w0.25: D28.2 122.49,39.06 123.57,39.06 124.33,39.81 125.85,39.81 MX28.2
NET-(D29-PAD2): length 18.5
  Top Layer w0.25: D29.2 163.27,95.67
  Bottom Layer w0.25: D29.2 163.74,100.05 162.07,106.93 MX29.2
NET-(D30-PAD2): length 18.5
  Top Layer w0.25: D30.2 D30.2
  Bottom Layer w0.25: D30.2 181.71,106.77 180.04,113.65 181.57,116.17
NET-(D31-PAD2): length 18.5
  Top Layer w0.25: D31.2 D31.2
  Bottom Layer w0.25: D31.2 199.66,113.46 197.98,120.37 199.52,122.89
NET-(D32-PAD2): length 18.5
  Top Layer w0.25: 215.68,110.77 D32.2
  Bottom Layer w0.25: MX32.2 217.06,122.65 218.73,115.78 215.68,110.77
NET-(D33-PAD2): length 18.5
  Top Layer w0.25: D33.2 D33.2
  Bottom Layer w0.25: D33.2 238.38,115.59 236.71,122.47 MX33.2
NET-(D34-PAD2): length 18.5
  Top Layer w0.25: D34.2 256.42,115.71
  Bottom Layer w0.25: MX34.2 255.22,126.97 256.89,120.09 D34.2
NET-(D35-PAD2): length 10.2
  Top Layer w0.25: D35.2 D35.2
  Bottom Layer w0.25: D35.2 164.24,93.29 168.1,90.94
NET-(D36-PAD2): length 10.2
  Top Layer w0.25: D36.2 D36.2
  Bottom Layer w0.25: D36.2 182.21,100.01 MX36.2
NET-(D37-PAD2): length 10.2
  Top Layer w0.25: D37.2 D37.2
  Bottom Layer w0.25: MX37.2 200.15,106.73 D37.2
NET-(D38-PAD2): length 10.2
  Top Layer w0.25: 216.28,108.3 D38.2
  Bottom Layer w0.25: 216.28,108.3 219.23,109.02 MX38.2
NET-(D39-PAD2): length 10.2
  Top Layer w0.25: D39.2 D39.2
  Bottom Layer w0.25: D39.2 238.88,108.83 MX39.2
NET-(D40-PAD2): length 10.2
  Top Layer w0.25: D40.2 D40.2
  Bottom Layer w0.25: 261.25,110.98 257.39,113.33 D40.2
NET-(D41-PAD2): length 18.5
  Top Layer w0.25: D41.2 172.27,58.65
  Bottom Layer w0.25: D41.2 172.74,63.03 171.07,69.91 MX41.2
NET-(D42-PAD2): length 18.5
  Top Layer w0.25: D42.2 190.24,65.37
  Bottom Layer w0.25: D42.2 190.71,69.75 189.04,76.63 MX42.2
NET-(D43-PAD2): length 18.6
  Top Layer w0.25: D43.2 D43.2
  Bottom Layer w0.25: D43.2 208.6,76.69 206.99,83.35 208.52,85.87
NET-(D44-PAD2): length 18.5
  Top Layer w0.25: 224.69,73.75 D44.2
  Bottom Layer w0.25: 224.69,73.75 227.73,78.75 226.06,85.63 MX44.2
NET-(D45-PAD2): length 18.5
  Top Layer w0.25: D45.2 246.91,74.19
  Bottom Layer w0.25: D45.2 247.39,78.57 245.71,85.45 MX45.2
NET-(D46-PAD2): length 18.5
  Top Layer w0.25: 262.85,78.06 D46.2
  Bottom Layer w0.25: 262.85,78.06 265.9,83.07 264.22,89.95 MX46.2
NET-(D47-PAD2): length 10.2
  Top Layer w0.25: D47.2 D47.2
  Bottom Layer w0.25: 177.11,53.92 173.24,56.27 D47.2
NET-(D48-PAD2): length 10.2
  Top Layer w0.25: D48.2 D48.2
  Bottom Layer w0.25: D48.2 191.21,62.99 MX48.2
NET-(D49-PAD2): length 10.4
  Top Layer w0.25: D49.2 D49.2
  Bottom Layer w0.25: D49.2 209.15,69.71 MX49.2
NET-(D50-PAD2): length 10.3
  Top Layer w0.25: 225.23,71.53 227.8,72.15
  Bottom Layer w0.25: MX50.2 227.93,72.18 225.23,71.53
NET-(D51-PAD2): length 10.2
  Top Layer w0.25: D51.2 247.51,71.72
  Bottom Layer w0.25: D51.2 247.88,71.81 MX51.2
NET-(D52-PAD2): length 10.2
  Top Layer w0.25: 263.45,75.6 266.02,76.22
  Bottom Layer w0.25: 263.45,75.6 266.39,76.31 MX52.2
NET-(D53-PAD2): length 11
  Top Layer w0.25: D53.2 D53.2
  Bottom Layer w0.25: MX53.2 164.54,32.2 D53.2
NET-(D54-PAD2): length 38.3
  Top Layer w0.25: D54.2 D54.2
  Bottom Layer w0.25: MX54.2 160.9,12.64 173.09,12.64 175.85,15.4 173.76,24.01 D54.2
NET-(D55-PAD2): length 10.3
  Top Layer w0.25: D55.2 D55.2
  Bottom Layer w0.25: MX55.2 187.42,37.76 D55.2
NET-(D56-PAD2): length 10.3
  Top Layer w0.25: D56.2 D56.2
  Bottom Layer w0.25: 209.3,42.1 205.39,44.48 D56.2
NET-(SW1-PAD1): length 48.4
  Top Layer w0.25: U1.22 151.63,80.06 151.63,113.51 SW1.1
ROW0: length 133.4
  Top Layer w0.25: U1.8 129.27,70.42 129.27,93.15 D6.1 127.94,94.96 112.54,98.71 112.53,98.7 111.66,98.91 D5.1 109.97,101.68 98.02,104.59 98.01,104.58 93.57,105.66 D4.1 91.88,108.44 77.71,111.88 D3.1 72.95,110.69 61.12,113.56 D2.1 53.3,110.5 36.78,114.52 D1.1
ROW1: length 133.7
  Top Layer w0.25: D7.1 36.18,112.05 52.7,108.03 D8.1 60.52,111.1 72.35,108.22 D9.1 77.11,109.42 91.28,105.97 D10.1 92.6,103.8 109.01,99.81 D11.1 110.69,97.05 126.98,93.08 D12.1 128.1,69.05 U1.9
ROW2: length 119
  Top Layer w0.25: D13.1 27.53,77.56 44.05,73.54 D15.1 51.87,76.6 63.7,73.73 D17.1 68.45,74.92 82.75,71.44 D19.1 84.44,68.67 84.81,68.58 84.82,68.59 100.72,64.72 D21.1 102.4,61.96 118.82,57.97 D23.1 123.09,60.25 U1.10
ROW3: length 119.6
  Top Layer w0.25: U1.11 122.42,57.71 D24.1 117.86,56.09 101.44,60.08 D22.1 99.76,62.85 83.47,66.81 D20.1 82.23,68.86 77.73,69.95 77.66,70.07 67.86,72.45 D18.1 63.1,71.26 51.27,74.14 D16.1 43.45,71.07 26.93,75.09 D14.1
ROW4: length 74.8
  Top Layer w0.25: D28.1 118.67,33.17 105.6,36.35 D26.1 102.99,38.54 D25.1 ; D28.1 119.42,38.69 120.87,40.14 120.87,42.09 120.9,42.11 120.9,42.77 121.66,43.54 121.66,44.51 122.21,45.06 123.19,45.06 131.16,53.04 133.77,53.04 135.07,54.34 135.07,54.69 U1.12 ; D28.1 D27.1
ROW5: length 145.1
  Top Layer w0.25: U1.17 152.14,67.87 152.14,87.94 161.32,97.12 166.28,97.12 D29.1 169.3,100.54 183.59,104.02 D30.1 187.27,107.27 201.56,110.74 D31.1 219.09,113.95 D32.1 226.45,109.47 240.27,112.84 D33.1 242.26,113.32 258.78,117.34 D34.1
ROW6: length 143.3
  Top Layer w0.25: D40.1 259.5,114.8 254.75,113.64 254.63,113.72 242.86,110.85 D39.1 240.87,110.37 227.05,107.01 D38.1 220.62,110.92 204.33,106.95 D37.1 202.17,108.27 187.87,104.8 D36.1 184.2,101.55 169.9,98.07 D35.1 169.89,91.65 169.89,83.08 U1.16
ROW7: length 129.4
  Top Layer w0.25: U1.15 175.14,60.25 D41.1 178.48,63.82 192.3,67.18 D42.1 196.27,70.24 210.32,73.66 D43.1 228.1,76.93 D44.1 235.46,72.45 243.68,74.45 243.68,74.46 249.27,75.82 D45.1 251.26,76.3 267.78,80.32 D46.1
ROW8: length 130.4
  Top Layer w0.25: U1.14 150.41,56.9 171.44,56.9 172.18,57.63 175.89,57.63 D47.1 178.9,61.05 193.2,64.53 D48.1 196.87,67.78 210.92,71.19 D49.1 213.09,69.87 229.87,73.96 D50.1 235.7,70.41 249.28,73.71 D51.1 251.86,73.83 268.38,77.85 D52.1
ROW9: length 79.4
  Top Layer w0.25: D56.1 208.58,45.39 207.5,46.05 193.08,42.54 D55.1 189.4,39.3 171.65,34.98 D53.1 ; D53.1 D54.1 ; D53.1 149.6,55.04 U1.13

## Text on the board
Top Silkscreen Layer: made by maverick for highway ysws
